# Altium schematic sheet 7_dout.SchDoc: Digital Outputs
size A4; DocumentNumber: 8; SheetNumber: 8; SheetTotal: 11
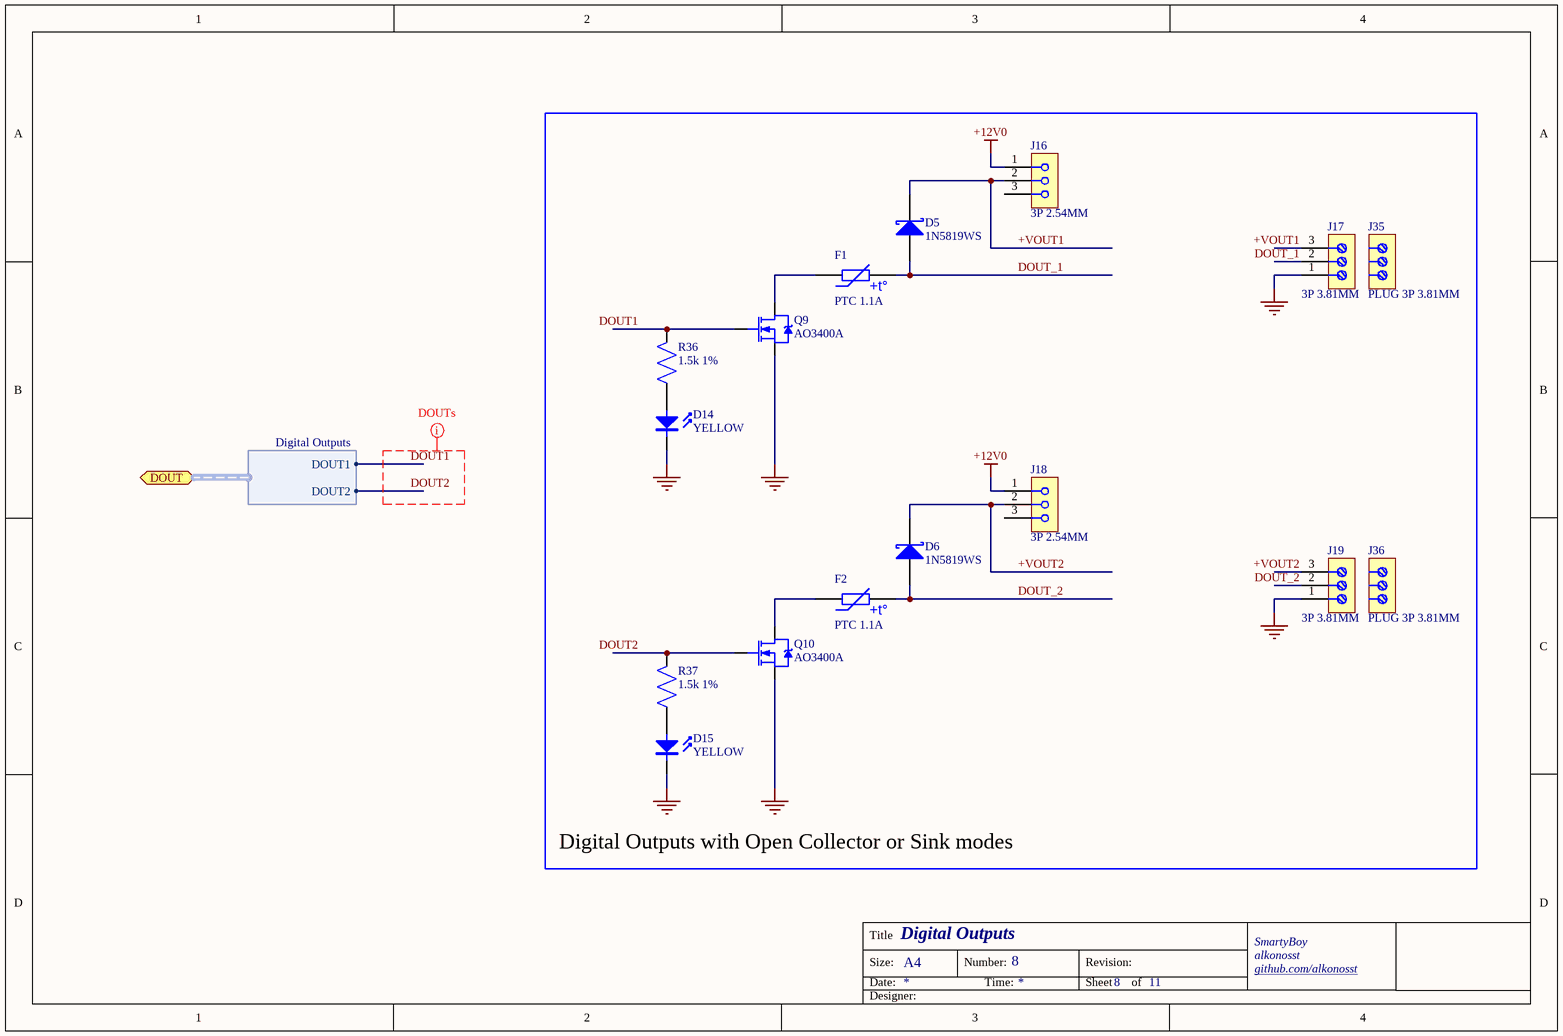
[diagram p0: 7_dout.SchDoc]

## Parts
D5  1N5819WS  [SOD-323]
D6  1N5819WS  [SOD-323]
D14  YELLOW  [LED0603-YELLOW]
D15  YELLOW  [LED0603-YELLOW]
F1  PTC 1.1A  [1812L]
F2  PTC 1.1A  [1812L]
J16  3P 2.54MM  [HDR-M-3P-2.54MM]
J17  3P 3.81MM  [TB-3P-3.81MM]  (no BOM)
J18  3P 2.54MM  [HDR-M-3P-2.54MM]
J19  3P 3.81MM  [TB-3P-3.81MM]  (no BOM)
J35  PLUG 3P 3.81MM  [TB-PLUG-3P-3.81MM]  (no BOM)
J36  PLUG 3P 3.81MM  [TB-PLUG-3P-3.81MM]  (no BOM)
Q9  AO3400A  [SOT-23-3]
Q10  AO3400A  [SOT-23-3]
R36  1.5k 1%  [R0603]
R37  1.5k 1%  [R0603]

## Blocks framed on the sheet
Digital Outputs with Open Collector or Sink modes: D5 D6 D14 D15 F1 F2 J16-J19 J35 J36 Q9 Q10 R36 R37

## Ports
DOUT (bidir, harness Digital Outputs)

## Harnesses
Digital Outputs: DOUT1, DOUT2

## Nets
+12V0: J16.1 J18.1
GND: D14.1 D15.1 J17.1 J19.1 Q9.2(S) Q10.2(S)
+VOUT1: D5.1(K) J16.2 J17.3
+VOUT2: D6.1(K) J18.2 J19.3
DOUT1: Q9.1(G) R36.2 ; port DOUT.DOUT1
DOUT2: Q10.1(G) R37.2 ; port DOUT.DOUT2
DOUT_1: D5.2(A) F1.2 J17.2
DOUT_2: D6.2(A) F2.2 J19.2
NetD14_2: D14.2 R36.1
NetD15_2: D15.2 R37.1
NetF1_1: F1.1 Q9.3(D)
NetF2_1: F2.1 Q10.3(D)

Not connected (* = marked no-connect by the designer): J16 3; J18 3

## Layout directives
net class DOUTs: DOUT1, DOUT2

## Notes on the sheet
- Title
- Size:
- Date:
- A4
- Number:
- Time:
- Revision:
- Sheet
- of
- SmartyBoy
- alkonosst
- github.com/alkonosst <http://github.com/alkonosst>
- Designer:
- (in symbol 1812L110/33MR) +t°

## Library data of the parts
D5 D6 = 1N5819WS: 40V 1A 600mV @ 1A SOD-323 Schottky Barrier Diodes (SBD); LCSC part: C191023; Category: Diodes: Schottky Barrier Diodes (SBD)
D14 D15 = 19-213/Y2C-CQ2R2L/3T(CY): Yellow 585.5~591.5nm 0603 Light Emitting Diodes (LED); LCSC part: C72038; Category: Optoelectronics: Light Emitting Diodes (LED)
F1 F2 = 1812L110/33MR: Polymeric 33V 200mΩ 1.95A 500ms 1812 PTC Resettable Fuses; LCSC part: C142747; Category: Fuses: PTC Resettable Fuses
J16 J18 = C49257: 3 2.54mm Straight 1 Header，Breakaway Through Hole Pin Header & Female Header; LCSC part: C49257; Category: Connectors: Pin Header & Female Header
J17 J19 = TBLOCK-3P-3.81MM: Terminal Block 3 Positions 3.81MM; Category: Connectors: Pluggable System Terminal Block
J35 J36 = PLUG-3P-3.81MM: Terminal block plug 3positions 3.81mm; Category: Connectors: Pluggable System Terminal Block
Q9 Q10 = AO3400A: 1.4W 0.0265Ω 5.7A,10V 30V 5.7A N Channel 1.5V 250uA SOT-23-3L MOSFETs; LCSC part: C20917; Category: Transistors: MOSFETs
R36 R37 = 0603WAF1501T5E: 1.5kΩ ±1% ±100ppm/℃ 0.1W 0603 Chip Resistor - Surface Mount; LCSC part: C22843; Category: Resistors: Chip Resistor - Surface Mount